# Altium schematic sheet ControleLeds.SchDoc: CONTROLADORA AIRPOPCORN
size A3; DocumentNumber: 10.00.0025; SheetNumber: 3; SheetTotal: 16
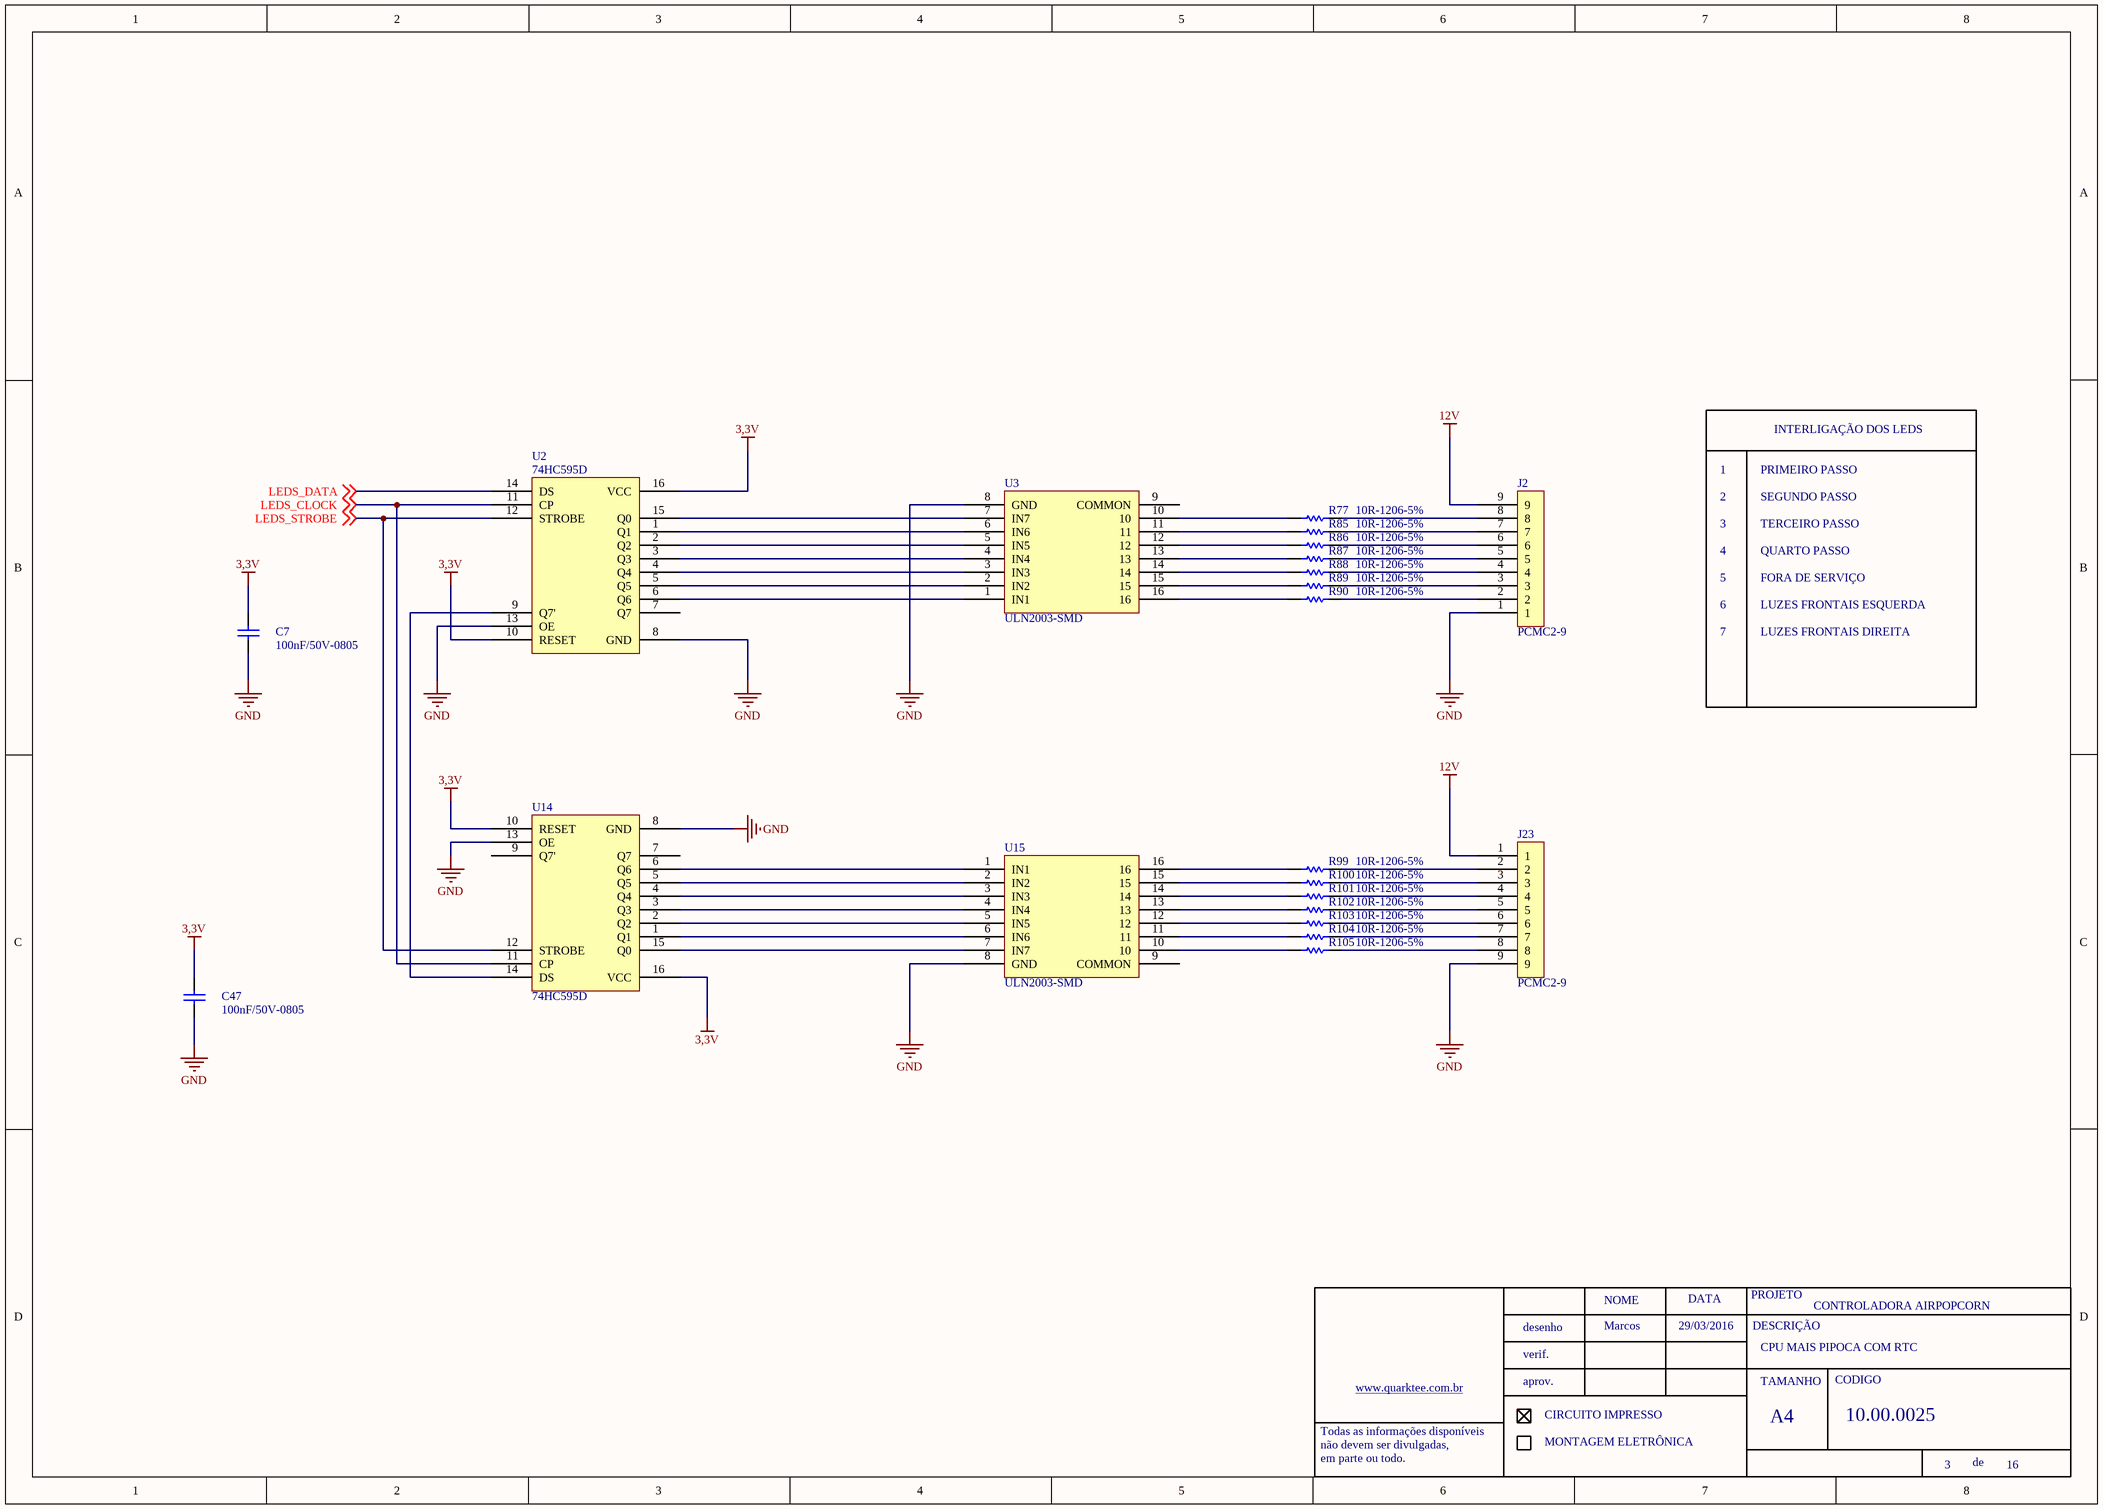
[diagram p0: ControleLeds.SchDoc]

## Parts
C7  100nF/50V-0805  [0805-REVISADO O]
C47  100nF/50V-0805  [0805-REVISADO O]
J2  PCMC2-9  [PCMC2-9]
J23  PCMC2-9  [PCMC2-9]
R77  10R-1206-5%  [1206-REVISADO O]
R85  10R-1206-5%  [1206-REVISADO O]
R86  10R-1206-5%  [1206-REVISADO O]
R87  10R-1206-5%  [1206-REVISADO O]
R88  10R-1206-5%  [1206-REVISADO O]
R89  10R-1206-5%  [1206-REVISADO O]
R90  10R-1206-5%  [1206-REVISADO O]
R99  10R-1206-5%  [1206-REVISADO O]
R100  10R-1206-5%  [1206-REVISADO O]
R101  10R-1206-5%  [1206-REVISADO O]
R102  10R-1206-5%  [1206-REVISADO O]
R103  10R-1206-5%  [1206-REVISADO O]
R104  10R-1206-5%  [1206-REVISADO O]
R105  10R-1206-5%  [1206-REVISADO O]
U2  74HC595D  [SOIC 16 PINOS]
U3  ULN2003-SMD  [SOIC 16 PINOS]
U14  74HC595D  [SOIC 16 PINOS]
U15  ULN2003-SMD  [SOIC 16 PINOS]

## Nets
3,3V: C7.2 C47.2 U2.10(RESET) U2.16(VCC) U14.10(RESET) U14.16(VCC)
12V: J2.9 J23.1
GND: C7.1 C47.1 J2.1 J23.9 U2.8(GND) U2.13(OE) U3.8(GND) U14.8(GND) U14.13(OE) U15.8(GND)
LEDS_CLOCK: U2.11(CP) U14.11(CP) ; off-sheet LEDS_CLOCK
LEDS_DATA: U2.14(DS) ; off-sheet LEDS_DATA
LEDS_STROBE: U2.12(STROBE) U14.12(STROBE) ; off-sheet LEDS_STROBE
NetJ2_2: J2.2 R90.2
NetJ2_3: J2.3 R89.2
NetJ2_4: J2.4 R88.2
NetJ2_5: J2.5 R87.2
NetJ2_6: J2.6 R86.2
NetJ2_7: J2.7 R85.2
NetJ2_8: J2.8 R77.2
NetJ23_2: J23.2 R99.2
NetJ23_3: J23.3 R100.2
NetJ23_4: J23.4 R101.2
NetJ23_5: J23.5 R102.2
NetJ23_6: J23.6 R103.2
NetJ23_7: J23.7 R104.2
NetJ23_8: J23.8 R105.2
NetR77_1: R77.1 U3.10
NetR85_1: R85.1 U3.11
NetR86_1: R86.1 U3.12
NetR87_1: R87.1 U3.13
NetR88_1: R88.1 U3.14
NetR89_1: R89.1 U3.15
NetR90_1: R90.1 U3.16
NetR99_1: R99.1 U15.16
NetR100_1: R100.1 U15.15
NetR101_1: R101.1 U15.14
NetR102_1: R102.1 U15.13
NetR103_1: R103.1 U15.12
NetR104_1: R104.1 U15.11
NetR105_1: R105.1 U15.10
NetU2_1: U2.1(Q1) U3.6(IN6)
NetU2_2: U2.2(Q2) U3.5(IN5)
NetU2_3: U2.3(Q3) U3.4(IN4)
NetU2_4: U2.4(Q4) U3.3(IN3)
NetU2_5: U2.5(Q5) U3.2(IN2)
NetU2_6: U2.6(Q6) U3.1(IN1)
NetU2_9: U2.9(Q7') U14.14(DS)
NetU2_15: U2.15(Q0) U3.7(IN7)
NetU14_1: U14.1(Q1) U15.6(IN6)
NetU14_2: U14.2(Q2) U15.5(IN5)
NetU14_3: U14.3(Q3) U15.4(IN4)
NetU14_4: U14.4(Q4) U15.3(IN3)
NetU14_5: U14.5(Q5) U15.2(IN2)
NetU14_6: U14.6(Q6) U15.1(IN1)
NetU14_15: U14.15(Q0) U15.7(IN7)

Not connected (* = marked no-connect by the designer): U2 7(Q7); U3 9(COMMON); U14 7(Q7) 9(Q7'); U15 9(COMMON)

## Notes on the sheet
- INTERLIGAÇÃO DOS LEDS
- 1
- 2
- PRIMEIRO PASSO
- SEGUNDO PASSO
- 3
- 4
- 5
- TERCEIRO PASSO
- QUARTO PASSO
- FORA DE SERVIÇO
- 6
- 7
- LUZES FRONTAIS ESQUERDA
- LUZES FRONTAIS DIREITA
- Marcos
- 29/03/2016
- CPU MAIS PIPOCA COM RTC
- NOME
- DATA
- PROJETO
- DESCRIÇÃO
- www.quarktee.com.br
- desenho
- verif.
- aprov.
- TAMANHO
- CODIGO
- Todas as informações disponíveis
- não devem ser divulgadas,
- em parte ou todo.
- CIRCUITO IMPRESSO
- MONTAGEM ELETRÔNICA
- A4
- de

## Library data of the parts
C7 C47 = 100nF/50-0805-NPO: ERP: 104.11.005
R77 R85-R90 R99-R105 = 10R-0805-5%
U2 U14 = 74HC595D: ERP: CADASTRAR
U3 U15 = ULN2003